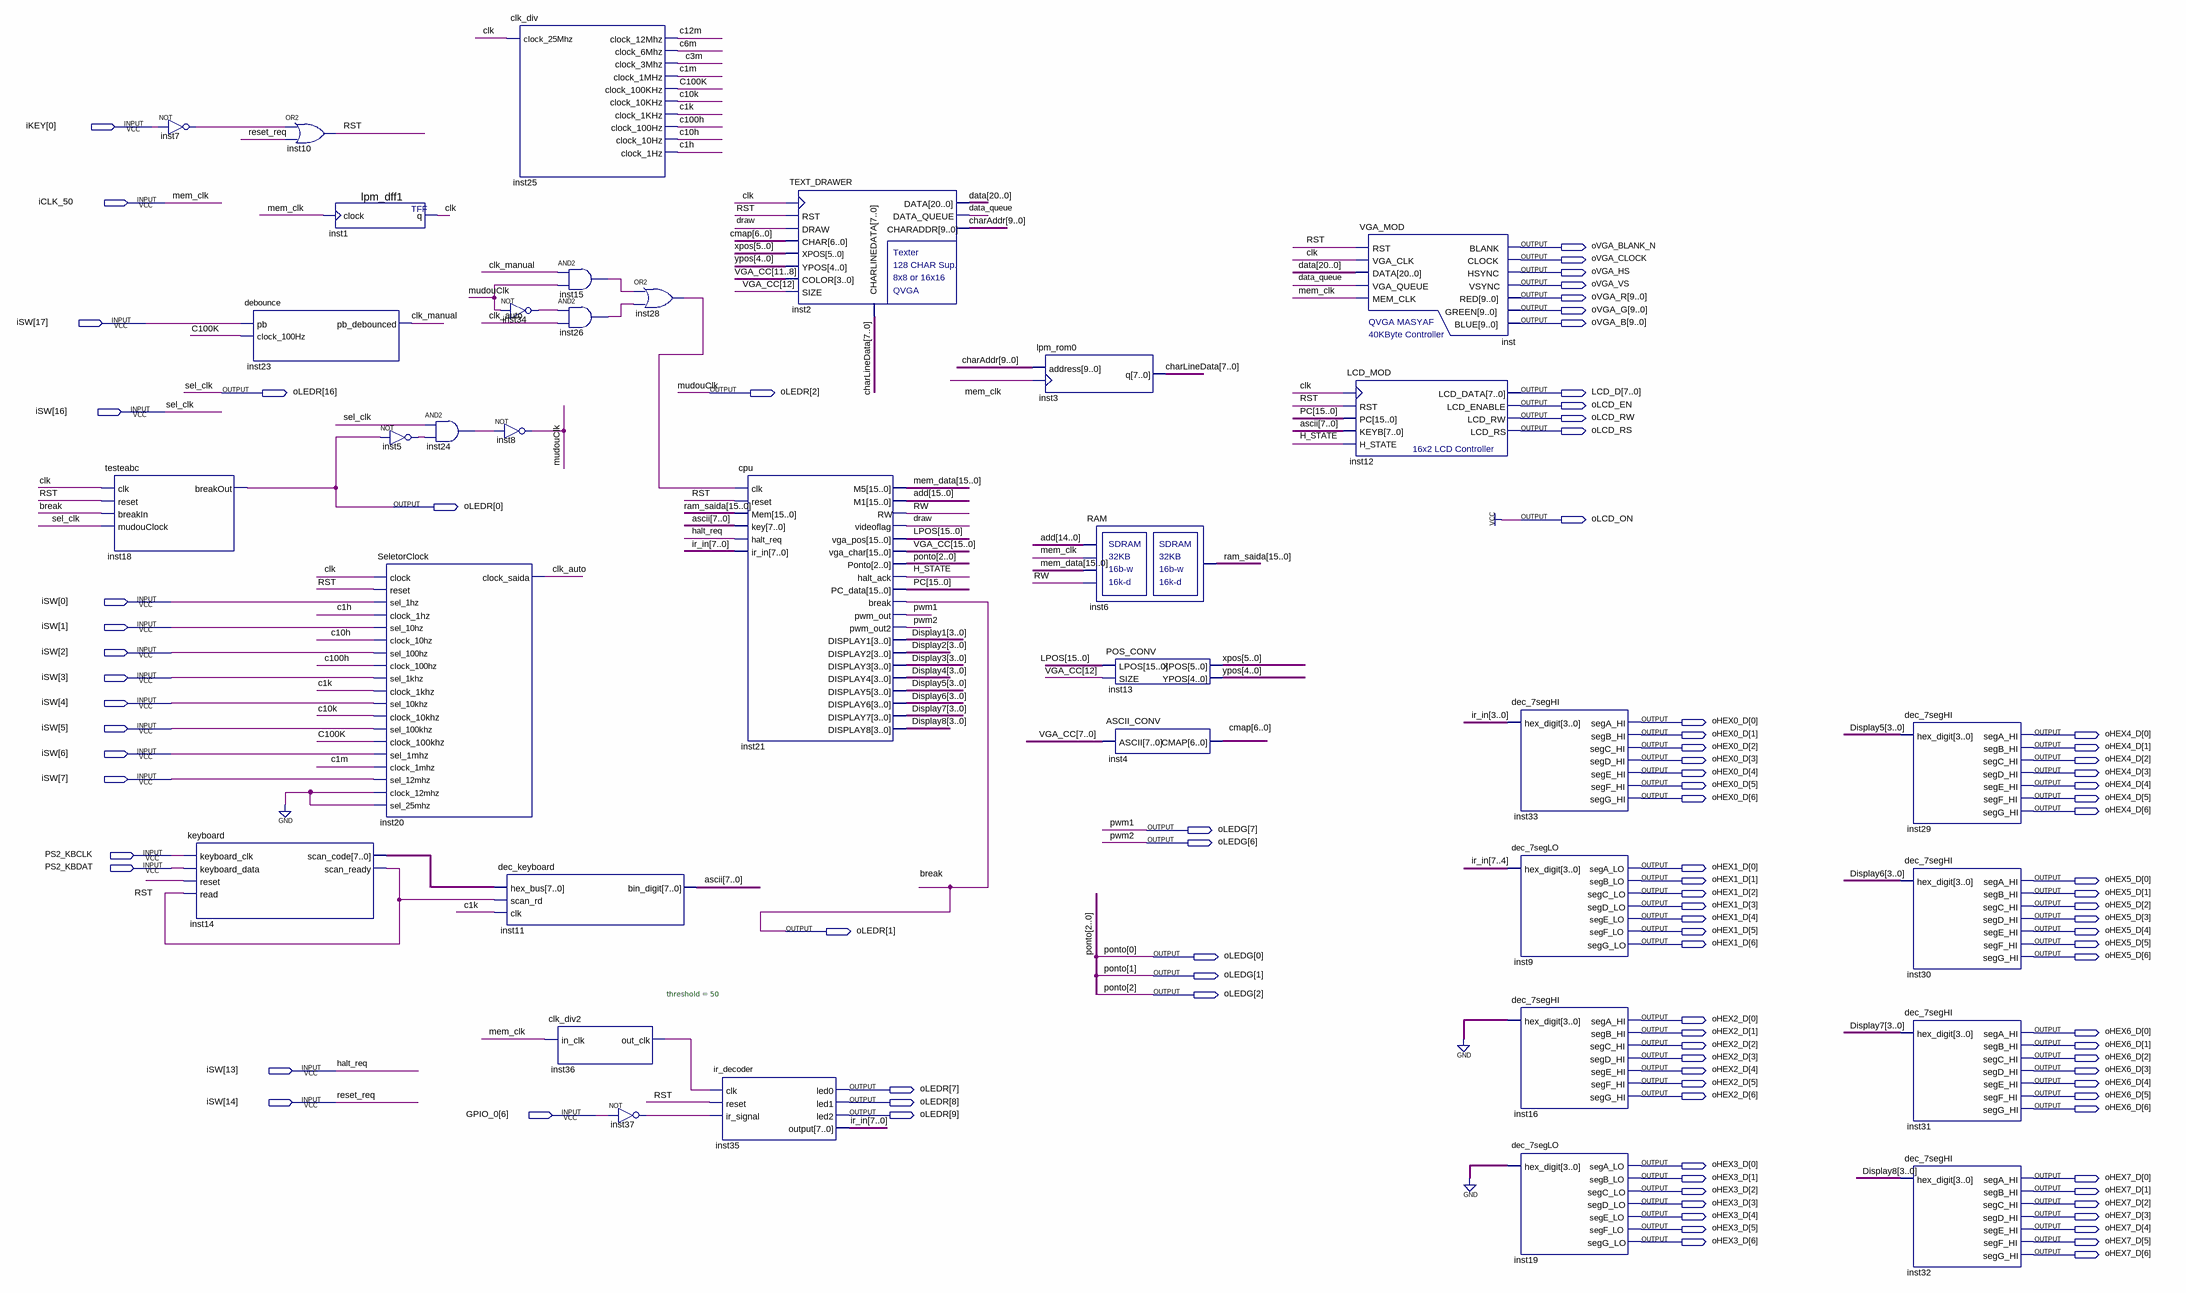
[diagram p0: schematic sheet]
// Quartus schematic AP9.bdf as structural Verilog: 35 symbols, 97 pins
module AP9 (
  input  [0:0] iKEY,
  input  iCLK_50,
  input  [17:0] iSW,
  input  PS2_KBCLK,
  input  PS2_KBDAT,
  input  [6:6] GPIO_0,
  output oVGA_BLANK_N,
  output oVGA_CLOCK,
  output oVGA_HS,
  output oVGA_VS,
  output [9:0] oVGA_R,
  output [9:0] oVGA_G,
  output [9:0] oVGA_B,
  output [16:0] oLEDR,
  output [7:0] LCD_D,
  output oLCD_EN,
  output oLCD_RW,
  output oLCD_RS,
  output oLCD_ON,
  output [6:0] oHEX0_D,
  output [6:0] oHEX4_D,
  output [7:0] oLEDG,
  output [6:0] oHEX1_D,
  output [6:0] oHEX5_D,
  output [6:0] oHEX2_D,
  output [6:0] oHEX6_D,
  output [6:0] oHEX3_D,
  output [6:0] oHEX7_D
);

  wire c1h, c1k, c1m, c3m, c6m, c10h, c10k, c12m, c100h, C100K, clk, clk_auto, clk_manual, data_queue, draw,
       H_STATE, inst5_out, inst7_out, inst14_scan_ready, inst15_out, inst24_out, inst26_out, inst28_out,
       inst34_out, inst36_out_clk, inst37_out, RST, RW;
  wire [3:0] Display1, Display2, Display3, Display4, Display5, Display6, Display7, Display8;
  wire [4:0] ypos;
  wire [5:0] xpos;
  wire [6:0] cmap;
  wire [7:0] ascii, charLineData, inst14_scan_code, ir_in;
  wire [9:0] charAddr;
  wire [15:0] add, LPOS, mem_data, PC, ram_saida, VGA_CC;
  wire [20:0] data;

  testeabc inst18 (.clk(clk), .reset(RST), .breakIn(oLEDR[1]), .mudouClock(iSW[16]), .breakOut(oLEDR[0]));
  not inst7 (inst7_out, iKEY[0]);
  keyboard inst14 (
    .keyboard_clk(PS2_KBCLK), .keyboard_data(PS2_KBDAT), .reset(RST), .read(inst14_scan_ready),
    .scan_code(inst14_scan_code), .scan_ready(inst14_scan_ready));
  debounce inst23 (.pb(iSW[17]), .clock_100Hz(C100K), .pb_debounced(clk_manual));
  or inst10 (RST, inst7_out, iSW[14]);
  lpm_dff1 inst1 (.clock(iCLK_50), .q(clk));
  not inst5 (inst5_out, oLEDR[0]);
  SeletorClock inst20 (
    .clock(clk), .reset(RST), .sel_1hz(iSW[0]), .clock_1hz(c1h), .sel_10hz(iSW[1]), .clock_10hz(c10h),
    .sel_100hz(iSW[2]), .clock_100hz(c100h), .sel_1khz(iSW[3]), .clock_1khz(c1k), .sel_10khz(iSW[4]),
    .clock_10khz(c10k), .sel_100khz(iSW[5]), .clock_100khz(C100K), .sel_1mhz(iSW[6]), .clock_1mhz(c1m),
    .sel_12mhz(iSW[7]), .clock_12mhz(1'b0), .sel_25mhz(1'b0), .clock_saida(clk_auto));
  and inst24 (inst24_out, iSW[16], inst5_out);
  clk_div inst25 (
    .clock_25Mhz(clk), .clock_12Mhz(c12m), .clock_6Mhz(c6m), .clock_3Mhz(c3m), .clock_1MHz(c1m),
    .clock_100KHz(C100K), .clock_10KHz(c10k), .clock_1KHz(c1k), .clock_100Hz(c100h), .clock_10Hz(c10h),
    .clock_1Hz(c1h));
  not inst34 (inst34_out, oLEDR[2]);
  not inst8 (oLEDR[2], inst24_out);
  dec_keyboard inst11 (.hex_bus(inst14_scan_code), .scan_rd(inst14_scan_ready), .clk(c1k), .bin_digit(ascii));
  and inst15 (inst15_out, clk_manual, oLEDR[2]);
  and inst26 (inst26_out, inst34_out, clk_auto);
  clk_div2 #(.threshold(50)) inst36 (.in_clk(iCLK_50), .out_clk(inst36_out_clk));
  not inst37 (inst37_out, GPIO_0[6]);
  or inst28 (inst28_out, inst15_out, inst26_out);
  ir_decoder inst35 (
    .clk(inst36_out_clk), .reset(RST), .ir_signal(inst37_out), .led0(oLEDR[7]), .led1(oLEDR[8]),
    .led2(oLEDR[9]), .\output (ir_in));
  cpu inst21 (
    .clk(inst28_out), .reset(RST), .Mem(ram_saida), .key(ascii), .halt_req(iSW[13]), .ir_in(ir_in),
    .M5(mem_data), .M1(add), .RW(RW), .videoflag(draw), .vga_pos(LPOS), .vga_char(VGA_CC),
    .Ponto(oLEDG[2:0]), .halt_ack(H_STATE), .PC_data(PC), .\break (oLEDR[1]), .pwm_out(oLEDG[7]),
    .pwm_out2(oLEDG[6]), .DISPLAY1(Display1), .DISPLAY2(Display2), .DISPLAY3(Display3), .DISPLAY4(Display4),
    .DISPLAY5(Display5), .DISPLAY6(Display6), .DISPLAY7(Display7), .DISPLAY8(Display8));
  TEXT_DRAWER inst2 (
    .RST(RST), .DRAW(draw), .XPOS(xpos), .YPOS(ypos), .COLOR(VGA_CC[11:8]), .SIZE(VGA_CC[12]),
    .CHARLINEDATA(charLineData), .CLK(clk), .CHAR(cmap), .DATA(data), .DATA_QUEUE(data_queue),
    .CHARADDR(charAddr));
  lpm_rom0 inst3 (.clock(iCLK_50), .address(charAddr), .q(charLineData));
  RAM inst6 (.clock(iCLK_50), .data(mem_data), .wren(RW), .address(add[14:0]), .q(ram_saida));
  POS_CONV inst13 (.LPOS(LPOS), .SIZE(VGA_CC[12]), .XPOS(xpos), .YPOS(ypos));
  ASCII_CONV inst4 (.ASCII(VGA_CC[7:0]), .CMAP(cmap));
  VGA_MOD inst (
    .RST(RST), .VGA_CLK(clk), .DATA(data), .VGA_QUEUE(data_queue), .MEM_CLK(iCLK_50), .BLANK(oVGA_BLANK_N),
    .CLOCK(oVGA_CLOCK), .HSYNC(oVGA_HS), .VSYNC(oVGA_VS), .RED(oVGA_R), .GREEN(oVGA_G), .BLUE(oVGA_B));
  LCD_MOD inst12 (
    .RST(RST), .PC(PC), .KEYB(ascii), .H_STATE(H_STATE), .CLK(clk), .LCD_DATA(LCD_D), .LCD_ENABLE(oLCD_EN),
    .LCD_RW(oLCD_RW), .LCD_RS(oLCD_RS));
  dec_7segHI inst33 (
    .hex_digit(ir_in[3:0]), .segA_HI(oHEX0_D[0]), .segB_HI(oHEX0_D[1]), .segC_HI(oHEX0_D[2]),
    .segD_HI(oHEX0_D[3]), .segE_HI(oHEX0_D[4]), .segF_HI(oHEX0_D[5]), .segG_HI(oHEX0_D[6]));
  dec_7segLO inst9 (
    .hex_digit(ir_in[7:4]), .segA_LO(oHEX1_D[0]), .segB_LO(oHEX1_D[1]), .segC_LO(oHEX1_D[2]),
    .segD_LO(oHEX1_D[3]), .segE_LO(oHEX1_D[4]), .segF_LO(oHEX1_D[5]), .segG_LO(oHEX1_D[6]));
  dec_7segHI inst16 (
    .hex_digit(4'b0000), .segA_HI(oHEX2_D[0]), .segB_HI(oHEX2_D[1]), .segC_HI(oHEX2_D[2]),
    .segD_HI(oHEX2_D[3]), .segE_HI(oHEX2_D[4]), .segF_HI(oHEX2_D[5]), .segG_HI(oHEX2_D[6]));
  dec_7segLO inst19 (
    .hex_digit(4'b0000), .segA_LO(oHEX3_D[0]), .segB_LO(oHEX3_D[1]), .segC_LO(oHEX3_D[2]),
    .segD_LO(oHEX3_D[3]), .segE_LO(oHEX3_D[4]), .segF_LO(oHEX3_D[5]), .segG_LO(oHEX3_D[6]));
  dec_7segHI inst29 (
    .hex_digit(Display5), .segA_HI(oHEX4_D[0]), .segB_HI(oHEX4_D[1]), .segC_HI(oHEX4_D[2]),
    .segD_HI(oHEX4_D[3]), .segE_HI(oHEX4_D[4]), .segF_HI(oHEX4_D[5]), .segG_HI(oHEX4_D[6]));
  dec_7segHI inst30 (
    .hex_digit(Display6), .segA_HI(oHEX5_D[0]), .segB_HI(oHEX5_D[1]), .segC_HI(oHEX5_D[2]),
    .segD_HI(oHEX5_D[3]), .segE_HI(oHEX5_D[4]), .segF_HI(oHEX5_D[5]), .segG_HI(oHEX5_D[6]));
  dec_7segHI inst31 (
    .hex_digit(Display7), .segA_HI(oHEX6_D[0]), .segB_HI(oHEX6_D[1]), .segC_HI(oHEX6_D[2]),
    .segD_HI(oHEX6_D[3]), .segE_HI(oHEX6_D[4]), .segF_HI(oHEX6_D[5]), .segG_HI(oHEX6_D[6]));
  dec_7segHI inst32 (
    .hex_digit(Display8), .segA_HI(oHEX7_D[0]), .segB_HI(oHEX7_D[1]), .segC_HI(oHEX7_D[2]),
    .segD_HI(oHEX7_D[3]), .segE_HI(oHEX7_D[4]), .segF_HI(oHEX7_D[5]), .segG_HI(oHEX7_D[6]));

  assign oLCD_ON = 1'b1;
  assign oLEDR[16] = iSW[16];

  // Other names for the same wires on the sheet: break = oLEDR[1]; halt_req = iSW[13]; mem_clk = iCLK_50;
  //   mudouClk = oLEDR[2]; ponto[2:0] = oLEDG[2:0]; pwm1 = oLEDG[7]; pwm2 = oLEDG[6]; reset_req = iSW[14];
  //   sel_clk = iSW[16]
endmodule
